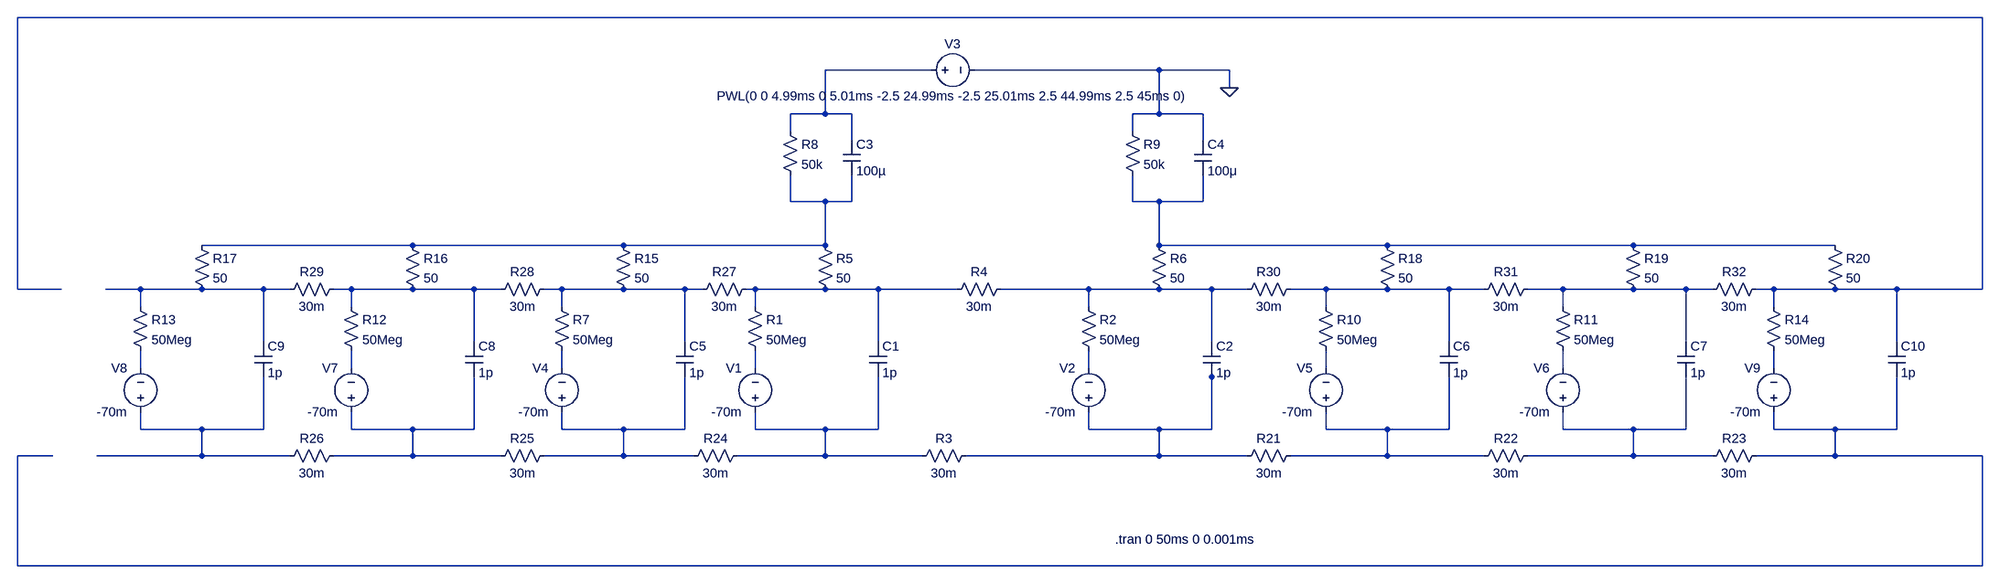
[diagram p0: schematic 電圧刺激等価回路_20200602.asc]
電圧刺激等価回路_20200602.asc, the LTspice schematic file:
Version 4
SHEET 1 2292 680
WIRE 2288 -464 -1344 -464
WIRE 320 -368 128 -368
WIRE 736 -368 400 -368
WIRE 864 -368 736 -368
WIRE 864 -336 864 -368
WIRE 128 -288 128 -368
WIRE 128 -288 64 -288
WIRE 176 -288 128 -288
WIRE 736 -288 736 -368
WIRE 736 -288 688 -288
WIRE 816 -288 736 -288
WIRE 64 -256 64 -288
WIRE 688 -256 688 -288
WIRE 176 -240 176 -288
WIRE 816 -240 816 -288
WIRE 64 -128 64 -176
WIRE 128 -128 64 -128
WIRE 176 -128 176 -176
WIRE 176 -128 128 -128
WIRE 688 -128 688 -176
WIRE 736 -128 688 -128
WIRE 816 -128 816 -176
WIRE 816 -128 736 -128
WIRE -624 -48 -1008 -48
WIRE -240 -48 -624 -48
WIRE 128 -48 128 -128
WIRE 128 -48 -240 -48
WIRE 736 -48 736 -128
WIRE 1152 -48 736 -48
WIRE 1600 -48 1152 -48
WIRE 1968 -48 1600 -48
WIRE -1344 32 -1344 -464
WIRE -1264 32 -1344 32
WIRE -1120 32 -1184 32
WIRE -1008 32 -1120 32
WIRE -896 32 -1008 32
WIRE -848 32 -896 32
WIRE -736 32 -768 32
WIRE -624 32 -736 32
WIRE -512 32 -624 32
WIRE -464 32 -512 32
WIRE -352 32 -384 32
WIRE -240 32 -352 32
WIRE -128 32 -240 32
WIRE -96 32 -128 32
WIRE 0 32 -16 32
WIRE 128 32 0 32
WIRE 224 32 128 32
WIRE 368 32 224 32
WIRE 608 32 448 32
WIRE 736 32 608 32
WIRE 832 32 736 32
WIRE 896 32 832 32
WIRE 1040 32 976 32
WIRE 1152 32 1040 32
WIRE 1264 32 1152 32
WIRE 1328 32 1264 32
WIRE 1472 32 1408 32
WIRE 1600 32 1472 32
WIRE 1696 32 1600 32
WIRE 1744 32 1696 32
WIRE 1856 32 1824 32
WIRE 1968 32 1856 32
WIRE 2080 32 1968 32
WIRE 2288 32 2288 -464
WIRE 2288 32 2080 32
WIRE -1120 64 -1120 32
WIRE -736 64 -736 32
WIRE -352 64 -352 32
WIRE 0 64 0 32
WIRE 608 64 608 32
WIRE 1040 64 1040 32
WIRE 1472 64 1472 32
WIRE 1856 64 1856 32
WIRE -896 128 -896 32
WIRE -512 128 -512 32
WIRE -128 128 -128 32
WIRE 224 128 224 32
WIRE 832 128 832 32
WIRE 1264 128 1264 32
WIRE 1696 128 1696 32
WIRE 2080 128 2080 32
WIRE -1120 176 -1120 144
WIRE -736 176 -736 144
WIRE -352 176 -352 144
WIRE 0 176 0 144
WIRE 608 176 608 144
WIRE 1040 176 1040 144
WIRE 1472 176 1472 144
WIRE 1856 176 1856 144
WIRE 832 192 832 176
WIRE -1120 288 -1120 256
WIRE -1008 288 -1120 288
WIRE -896 288 -896 192
WIRE -896 288 -1008 288
WIRE -736 288 -736 256
WIRE -624 288 -736 288
WIRE -512 288 -512 192
WIRE -512 288 -624 288
WIRE -352 288 -352 256
WIRE -240 288 -352 288
WIRE -128 288 -128 192
WIRE -128 288 -240 288
WIRE 0 288 0 256
WIRE 128 288 0 288
WIRE 224 288 224 192
WIRE 224 288 128 288
WIRE 608 288 608 256
WIRE 736 288 608 288
WIRE 832 288 832 192
WIRE 832 288 736 288
WIRE 1040 288 1040 256
WIRE 1152 288 1040 288
WIRE 1264 288 1264 192
WIRE 1264 288 1152 288
WIRE 1472 288 1472 256
WIRE 1600 288 1472 288
WIRE 1696 288 1696 192
WIRE 1696 288 1600 288
WIRE 1856 288 1856 256
WIRE 1968 288 1856 288
WIRE 2080 288 2080 192
WIRE 2080 288 1968 288
WIRE -1280 336 -1344 336
WIRE -1008 336 -1008 288
WIRE -1008 336 -1200 336
WIRE -848 336 -1008 336
WIRE -624 336 -624 288
WIRE -624 336 -768 336
WIRE -464 336 -624 336
WIRE -240 336 -240 288
WIRE -240 336 -384 336
WIRE -112 336 -240 336
WIRE 128 336 128 288
WIRE 128 336 -32 336
WIRE 304 336 128 336
WIRE 736 336 736 288
WIRE 736 336 384 336
WIRE 896 336 736 336
WIRE 1152 336 1152 288
WIRE 1152 336 976 336
WIRE 1328 336 1152 336
WIRE 1600 336 1600 288
WIRE 1600 336 1408 336
WIRE 1744 336 1600 336
WIRE 1968 336 1968 288
WIRE 1968 336 1824 336
WIRE 2288 336 1968 336
WIRE -1344 560 -1344 336
WIRE 2288 560 2288 336
WIRE 2288 560 -1344 560
FLAG 864 -336 0
SYMBOL voltage 304 -368 R270
WINDOW 0 32 56 VTop 2
WINDOW 3 -32 56 VBottom 2
WINDOW 123 0 0 Left 0
WINDOW 39 0 0 Left 0
SYMATTR InstName V3
SYMATTR Value PWL(0 0 4.99ms 0 5.01ms -2.5 24.99ms -2.5 25.01ms 2.5 44.99ms 2.5 45ms 0)
SYMBOL res -16 48 R0
SYMATTR InstName R1
SYMATTR Value 50Meg
SYMBOL res 592 48 R0
SYMATTR InstName R2
SYMATTR Value 50Meg
SYMBOL res 400 320 R90
WINDOW 0 0 56 VBottom 2
WINDOW 3 32 56 VTop 2
SYMATTR InstName R3
SYMATTR Value 30m
SYMBOL res 112 -64 R0
SYMATTR InstName R5
SYMATTR Value 50
SYMBOL res 720 -64 R0
SYMATTR InstName R6
SYMATTR Value 50
SYMBOL cap 208 128 R0
SYMATTR InstName C1
SYMATTR Value 1p
SYMBOL cap 816 128 R0
SYMATTR InstName C2
SYMATTR Value 1p
SYMBOL cap 160 -240 R0
SYMATTR InstName C3
SYMATTR Value 100µ
SYMBOL cap 800 -240 R0
SYMATTR InstName C4
SYMATTR Value 100μ
SYMBOL res 48 -272 R0
SYMATTR InstName R8
SYMATTR Value 50k
SYMBOL res 672 -272 R0
SYMATTR InstName R9
SYMATTR Value 50k
SYMBOL voltage 0 272 R180
WINDOW 0 24 96 Left 2
WINDOW 3 24 16 Left 2
SYMATTR InstName V1
SYMATTR Value -70m
SYMBOL voltage 608 272 R180
WINDOW 0 24 96 Left 2
WINDOW 3 24 16 Left 2
SYMATTR InstName V2
SYMATTR Value -70m
SYMBOL res 464 16 R90
WINDOW 0 0 56 VBottom 2
WINDOW 3 32 56 VTop 2
SYMATTR InstName R4
SYMATTR Value 30m
SYMBOL res -368 48 R0
SYMATTR InstName R7
SYMATTR Value 50Meg
SYMBOL cap -144 128 R0
SYMATTR InstName C5
SYMATTR Value 1p
SYMBOL voltage -352 272 R180
WINDOW 0 24 96 Left 2
WINDOW 3 24 16 Left 2
SYMATTR InstName V4
SYMATTR Value -70m
SYMBOL res 1024 48 R0
SYMATTR InstName R10
SYMATTR Value 50Meg
SYMBOL cap 1248 128 R0
SYMATTR InstName C6
SYMATTR Value 1p
SYMBOL voltage 1040 272 R180
WINDOW 0 24 96 Left 2
WINDOW 3 24 16 Left 2
SYMATTR InstName V5
SYMATTR Value -70m
SYMBOL res 1456 48 R0
SYMATTR InstName R11
SYMATTR Value 50Meg
SYMBOL cap 1680 128 R0
SYMATTR InstName C7
SYMATTR Value 1p
SYMBOL voltage 1472 272 R180
WINDOW 0 24 96 Left 2
WINDOW 3 24 16 Left 2
SYMATTR InstName V6
SYMATTR Value -70m
SYMBOL res -752 48 R0
SYMATTR InstName R12
SYMATTR Value 50Meg
SYMBOL cap -528 128 R0
SYMATTR InstName C8
SYMATTR Value 1p
SYMBOL voltage -736 272 R180
WINDOW 0 24 96 Left 2
WINDOW 3 24 16 Left 2
SYMATTR InstName V7
SYMATTR Value -70m
SYMBOL res -1136 48 R0
SYMATTR InstName R13
SYMATTR Value 50Meg
SYMBOL cap -912 128 R0
SYMATTR InstName C9
SYMATTR Value 1p
SYMBOL voltage -1120 272 R180
WINDOW 0 24 96 Left 2
WINDOW 3 24 16 Left 2
SYMATTR InstName V8
SYMATTR Value -70m
SYMBOL res 1840 48 R0
SYMATTR InstName R14
SYMATTR Value 50Meg
SYMBOL cap 2064 128 R0
SYMATTR InstName C10
SYMATTR Value 1p
SYMBOL voltage 1856 272 R180
WINDOW 0 24 96 Left 2
WINDOW 3 24 16 Left 2
SYMATTR InstName V9
SYMATTR Value -70m
SYMBOL res -256 -64 R0
SYMATTR InstName R15
SYMATTR Value 50
SYMBOL res -640 -64 R0
SYMATTR InstName R16
SYMATTR Value 50
SYMBOL res -1024 -64 R0
SYMATTR InstName R17
SYMATTR Value 50
SYMBOL res 1136 -64 R0
SYMATTR InstName R18
SYMATTR Value 50
SYMBOL res 1584 -64 R0
SYMATTR InstName R19
SYMATTR Value 50
SYMBOL res 1952 -64 R0
SYMATTR InstName R20
SYMATTR Value 50
SYMBOL res 992 320 R90
WINDOW 0 0 56 VBottom 2
WINDOW 3 32 56 VTop 2
SYMATTR InstName R21
SYMATTR Value 30m
SYMBOL res 1424 320 R90
WINDOW 0 0 56 VBottom 2
WINDOW 3 32 56 VTop 2
SYMATTR InstName R22
SYMATTR Value 30m
SYMBOL res 1840 320 R90
WINDOW 0 0 56 VBottom 2
WINDOW 3 32 56 VTop 2
SYMATTR InstName R23
SYMATTR Value 30m
SYMBOL res -16 320 R90
WINDOW 0 0 56 VBottom 2
WINDOW 3 32 56 VTop 2
SYMATTR InstName R24
SYMATTR Value 30m
SYMBOL res -368 320 R90
WINDOW 0 0 56 VBottom 2
WINDOW 3 32 56 VTop 2
SYMATTR InstName R25
SYMATTR Value 30m
SYMBOL res -752 320 R90
WINDOW 0 0 56 VBottom 2
WINDOW 3 32 56 VTop 2
SYMATTR InstName R26
SYMATTR Value 30m
SYMBOL res 0 16 R90
WINDOW 0 0 56 VBottom 2
WINDOW 3 32 56 VTop 2
SYMATTR InstName R27
SYMATTR Value 30m
SYMBOL res -368 16 R90
WINDOW 0 0 56 VBottom 2
WINDOW 3 32 56 VTop 2
SYMATTR InstName R28
SYMATTR Value 30m
SYMBOL res -752 16 R90
WINDOW 0 0 56 VBottom 2
WINDOW 3 32 56 VTop 2
SYMATTR InstName R29
SYMATTR Value 30m
SYMBOL res 992 16 R90
WINDOW 0 0 56 VBottom 2
WINDOW 3 32 56 VTop 2
SYMATTR InstName R30
SYMATTR Value 30m
SYMBOL res 1424 16 R90
WINDOW 0 0 56 VBottom 2
WINDOW 3 32 56 VTop 2
SYMATTR InstName R31
SYMATTR Value 30m
SYMBOL res 1840 16 R90
WINDOW 0 0 56 VBottom 2
WINDOW 3 32 56 VTop 2
SYMATTR InstName R32
SYMATTR Value 30m
TEXT 656 512 Left 2 !.tran 0 50ms 0 0.001ms

The netlist it stands for:
* 電圧刺激等価回路_20200602.asc
V3 N002 0 PWL(0 0 4.99ms 0 5.01ms -2.5 24.99ms -2.5 25.01ms 2.5 44.99ms 2.5 45ms 0)
R1 N008 N015 50Meg
R2 N009 N016 50Meg
R3 N020 N024 30m
R5 N003 N008 50
R6 N004 N009 50
C1 N008 N024 1p
C2 N009 N020 1p
C3 N002 N003 100µ
C4 0 N004 100μ
R8 N002 N003 50k
R9 0 N004 50k
V1 N024 N015 -70m
V2 N020 N016 -70m
R4 N009 N008 30m
R7 N007 N014 50Meg
C5 N007 N023 1p
V4 N023 N014 -70m
R10 N010 N017 50Meg
C6 N010 N025 1p
V5 N025 N017 -70m
R11 N011 N018 50Meg
C7 N011 N026 1p
V6 N026 N018 -70m
R12 N006 N013 50Meg
C8 N006 N022 1p
V7 N022 N013 -70m
R13 N005 N012 50Meg
C9 N005 N021 1p
V8 N021 N012 -70m
R14 N001 N019 50Meg
C10 N001 N027 1p
V9 N027 N019 -70m
R15 N003 N007 50
R16 N003 N006 50
R17 N003 N005 50
R18 N004 N010 50
R19 N004 N011 50
R20 N004 N001 50
R21 N025 N020 30m
R22 N026 N025 30m
R23 N027 N026 30m
R24 N024 N023 30m
R25 N023 N022 30m
R26 N022 N021 30m
R27 N008 N007 30m
R28 N007 N006 30m
R29 N006 N005 30m
R30 N010 N009 30m
R31 N011 N010 30m
R32 N001 N011 30m
.tran 0 50ms 0 0.001ms
.backanno
.end